# Altium schematic sheet Arduino FPGA SPI MUX.SchDoc
size A4
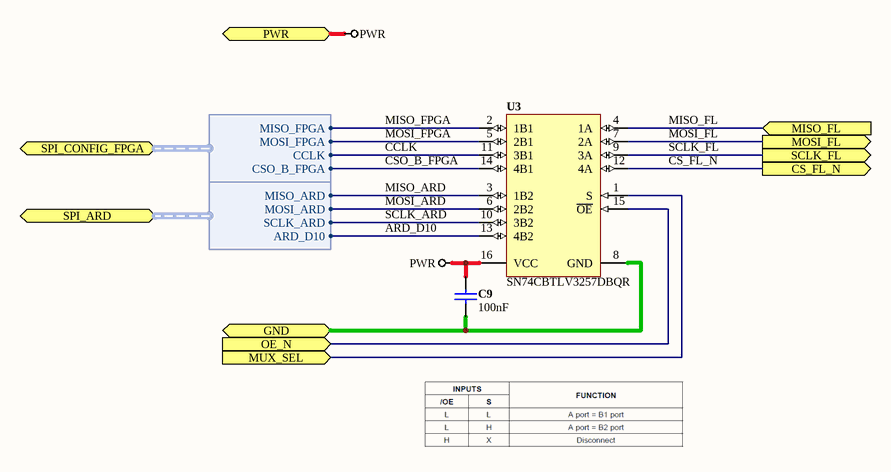
[diagram p0: Arduino FPGA SPI MUX.SchDoc]

## Parts
C9  value 100nF  [CAPC0402(1005)60_L]  (hidden comment: CAP 100nF 16V 0402(1005))
U3  SN74CBTLV3257DBQR  [DBQ16]

## Ports
CS_FL_N (out), GND, MISO_FL (in), MOSI_FL (out), MUX_SEL (in), OE_N (in), PWR, SCLK_FL (out), SPI_ARD (harness SPI_ARD), SPI_CONFIG_FPGA (harness SPI_CONFIG_FPGA)

## Harnesses
SPI_CONFIG_FPGA: CSO_B_FPGA, CCLK, MISO_FPGA, MOSI_FPGA
SPI_ARD: MISO_ARD, MOSI_ARD, SCLK_ARD, ARD_D10

## Nets
PWR: C9.1 U3.16(VCC) ; port PWR
ARD_D10: U3.13(4B2) ; port SPI_ARD.ARD_D10
CCLK: U3.11(3B1) ; port SPI_CONFIG_FPGA.CCLK
CS_FL_N: U3.12(4A) ; port CS_FL_N
CSO_B_FPGA: U3.14(4B1) ; port SPI_CONFIG_FPGA.CSO_B_FPGA
GND: C9.2 U3.8(GND) ; port GND
MISO_ARD: U3.3(1B2) ; port SPI_ARD.MISO_ARD
MISO_FL: U3.4(1A) ; port MISO_FL
MISO_FPGA: U3.2(1B1) ; port SPI_CONFIG_FPGA.MISO_FPGA
MOSI_ARD: U3.6(2B2) ; port SPI_ARD.MOSI_ARD
MOSI_FL: U3.7(2A) ; port MOSI_FL
MOSI_FPGA: U3.5(2B1) ; port SPI_CONFIG_FPGA.MOSI_FPGA
MUX_SEL: U3.1(S) ; port MUX_SEL
OE_N: U3.15(~{OE}) ; port OE_N
SCLK_ARD: U3.10(3B2) ; port SPI_ARD.SCLK_ARD
SCLK_FL: U3.9(3A) ; port SCLK_FL

## Library data of the parts
C9 = CAP 100nF 16V ±10% 0402 (1005 Metric) Thickness 0.6mm SMD: Manufacturer_PN: C0402C104K8PACTU; Case-EIA: 0402; Case-Metric: 1005; Tolerance: ±10%; Max Thickness: 0.6 mm; Rated Voltage: 16 V; Technology: SMT; Manufacturer Part Number: C0402C104K8PACTU
U3 = SN74CBTLV3257DBQR: Low-Voltage 4-Bit 1-Of-2 FET Multiplexer/Demultiplexer, 16-pin SOP (DBQ16); Supply Voltage: 2.3 to 3.6 V; Channel: 4; DatasheetVersion: SCDS040J, 10/2003; Mounting Technology: Surface Mount; PartNumber: SN74CBTLV3257DBQR; ComponentLink3URL: http://www.ti.com/lit/ml/msoi004g/msoi004g.pdf; ComponentLink2Description: Datasheet; ComponentLink1URL: http://www.ti.com/; PackageVersion: 4073301-2/H, 10/2008; ComponentLink1Description: Manufacturer URL; ComponentLink3Description: Package Specification; PackageDescription: 16-Pin Plastic Small Outline, 3.9 x 4.9 mm Body, 0.635 mm Pitch; ComponentLink2URL: http://www.ti.com/lit/ds/symlink/sn74cbtlv3257.pdf; PackageReference: DBQ16; Manufacturer_PN: SN74CBTLV3257DBQR; Manufacturer Part Number: SN74CBTLV3257DBQR